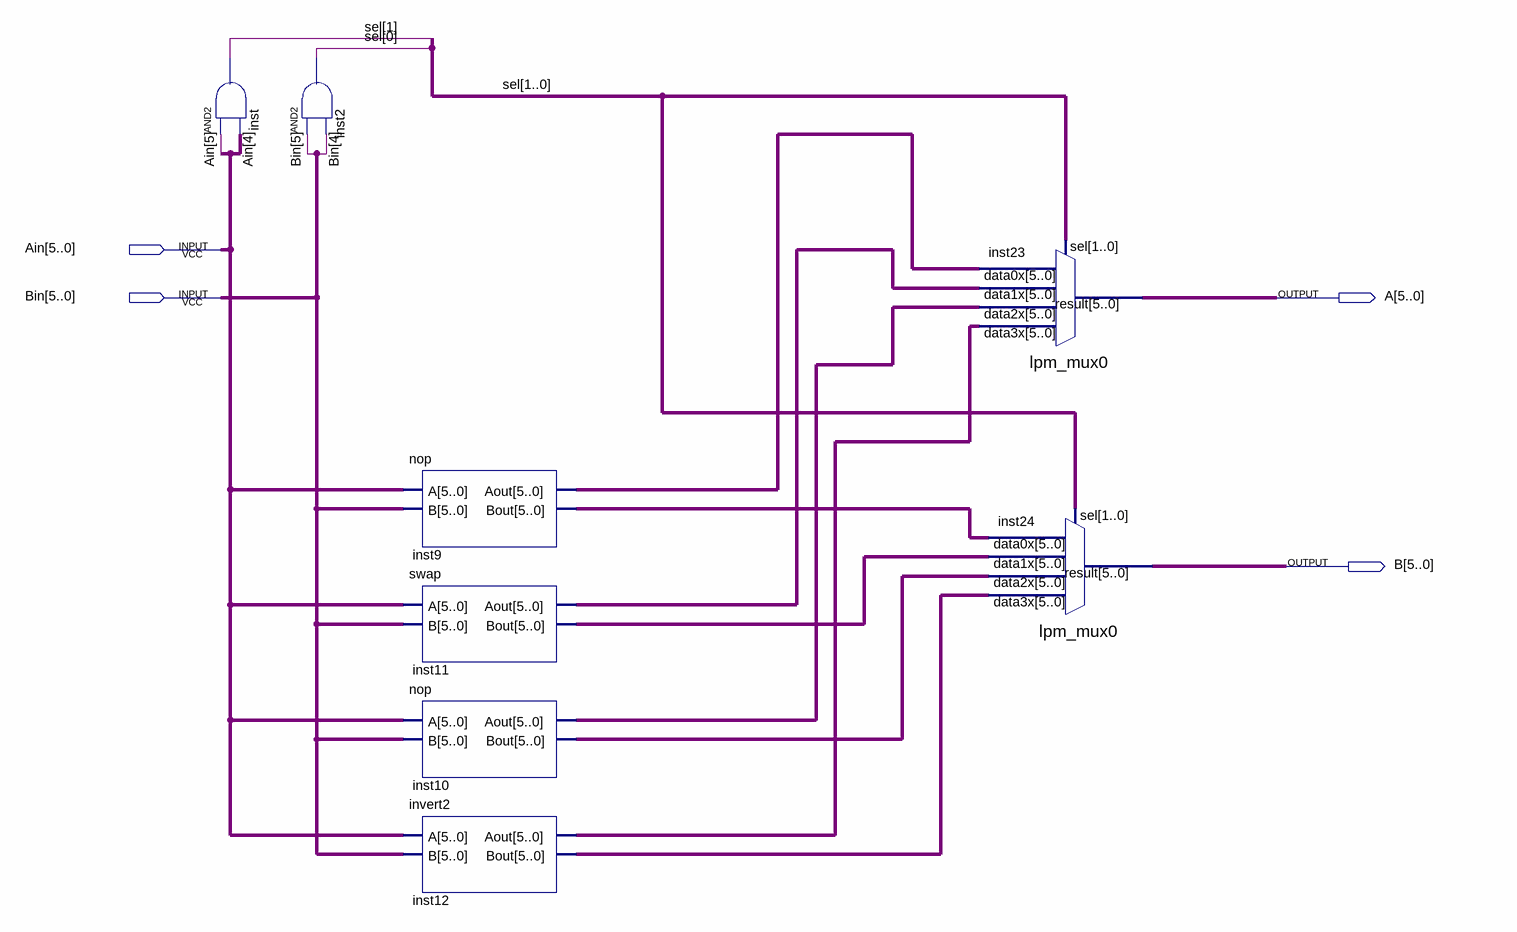
[diagram p0: schematic sheet]
// Quartus schematic normalize.bdf as structural Verilog: 8 symbols, 4 pins
module normalize (
  input  [5:0] Ain,
  input  [5:0] Bin,
  output [5:0] A,
  output [5:0] B
);

  wire [1:0] sel;
  wire [5:0] inst9_aout, inst9_bout, inst10_aout, inst10_bout, inst11_aout, inst11_bout, inst12_aout,
       inst12_bout;

  and inst (sel[1], Ain[5], Ain[4]);
  and inst2 (sel[0], Bin[5], Bin[4]);
  nop inst9 (.A(Ain), .B(Bin), .Aout(inst9_aout), .Bout(inst9_bout));
  swap inst11 (.A(Ain), .B(Bin), .Aout(inst11_aout), .Bout(inst11_bout));
  nop inst10 (.A(Ain), .B(Bin), .Aout(inst10_aout), .Bout(inst10_bout));
  invert2 inst12 (.A(Ain), .B(Bin), .Aout(inst12_aout), .Bout(inst12_bout));
  lpm_mux0 inst23 (
    .data3x(inst12_aout), .data2x(inst10_aout), .data1x(inst11_aout), .data0x(inst9_aout), .sel(sel),
    .result(A));
  lpm_mux0 inst24 (
    .data3x(inst12_bout), .data2x(inst10_bout), .data1x(inst11_bout), .data0x(inst9_bout), .sel(sel),
    .result(B));
endmodule
